# EAGLE design Synth_pcb_v1 (EAGLE 9.5.1)
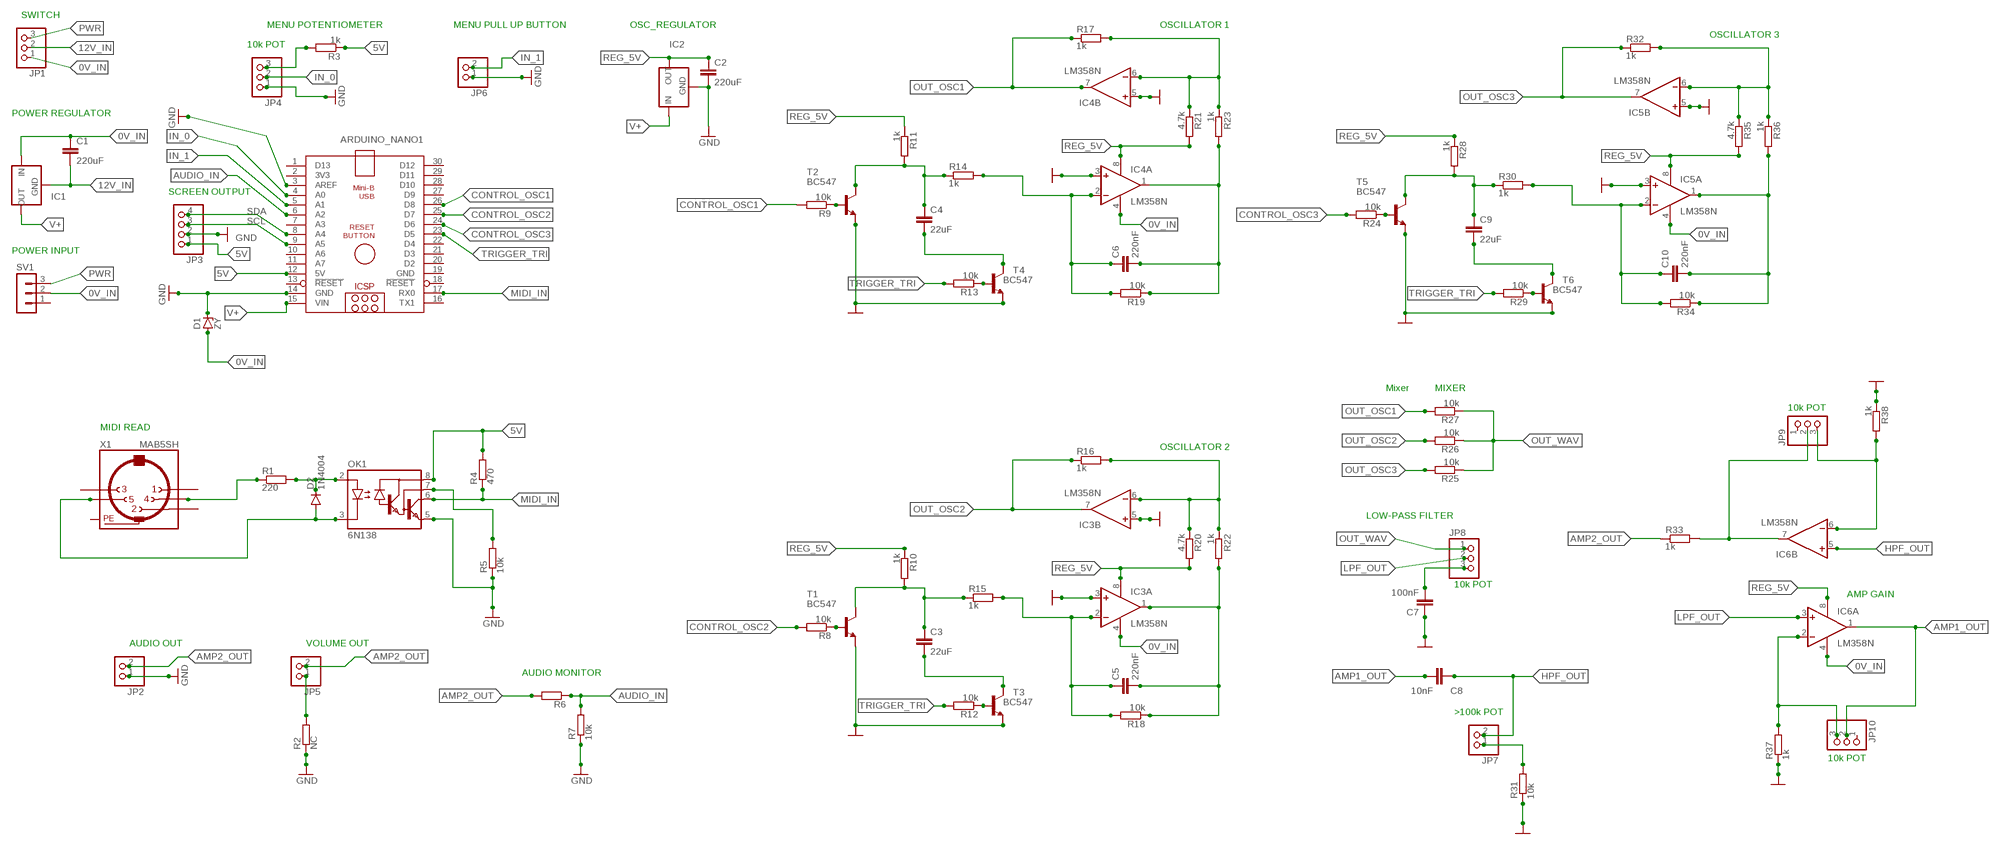
[diagram p0: schematic, sheet 1]

## Parts
ARDUINO_NANO1  ARDUINO_NANO  [ARDUINO_NANO]
C1  220uF  C2,5-3  [C2.5-3]
C2  220uF  C2,5-3  [C2.5-3]
C3  22uF  C2,5-3  [C2.5-3]
C4  22uF  C2,5-3  [C2.5-3]
C5  220nF  C2,5-3  [C2.5-3]
C6  220nF  C2,5-3  [C2.5-3]
C7  100nF  C2,5-3  [C2.5-3]
C8  10nF  C2,5-3  [C2.5-3]
C9  22uF  C2,5-3  [C2.5-3]
C10  220nF  C2,5-3  [C2.5-3]
D1  ZY  [P1Z12]
D2  1N4004  [DO41-10]
IC1  79XXS  [79XXS]
IC2  78XXS  [78XXS]
IC3  LM358N  [DIL08]
IC4  LM358N  [DIL08]
IC5  LM358N  [DIL08]
IC6  LM358N  [DIL08]
JP1  PINHD-1X3  [1X03]
JP2  PINHD-1X2  [1X02]
JP3  PINHD-1X4  [1X04]
JP4  PINHD-1X3  [1X03]
JP5  PINHD-1X2  [1X02]
JP6  PINHD-1X2  [1X02]
JP7  PINHD-1X2  [1X02]
JP8  PINHD-1X3  [1X03]
JP9  PINHD-1X3  [1X03]
JP10  PINHD-1X3  [1X03]
OK1  6N138  [DIL08]
R1  220  R-EU_0204/7  [0204/7]
R2  NC  R-EU_0204/7  [0204/7]
R3  1k  R-EU_0204/7  [0204/7]
R4  470  R-EU_0204/7  [0204/7]
R5  10k  R-EU_0204/7  [0204/7]
R6  1k  R-EU_0204/7  [0204/7]
R7  10k  R-EU_0204/7  [0204/7]
R8  10k  R-EU_0204/7  [0204/7]
R9  10k  R-EU_0204/7  [0204/7]
R10  1k  R-EU_0204/7  [0204/7]
R11  1k  R-EU_0204/7  [0204/7]
R12  10k  R-EU_0204/7  [0204/7]
R13  10k  R-EU_0204/7  [0204/7]
R14  1k  R-EU_0204/7  [0204/7]
R15  1k  R-EU_0204/7  [0204/7]
R16  1k  R-EU_0204/7  [0204/7]
R17  1k  R-EU_0204/7  [0204/7]
R18  10k  R-EU_0204/7  [0204/7]
R19  10k  R-EU_0204/7  [0204/7]
R20  4.7k  R-EU_0204/7  [0204/7]
R21  4.7k  R-EU_0204/7  [0204/7]
R22  1k  R-EU_0204/7  [0204/7]
R23  1k  R-EU_0204/7  [0204/7]
R24  10k  R-EU_0204/7  [0204/7]
R25  10k  R-EU_0204/7  [0204/7]
R26  10k  R-EU_0204/7  [0204/7]
R27  10k  R-EU_0204/7  [0204/7]
R28  1k  R-EU_0204/7  [0204/7]
R29  10k  R-EU_0204/7  [0204/7]
R30  1k  R-EU_0204/7  [0204/7]
R31  10k  R-EU_0204/7  [0204/7]
R32  1k  R-EU_0204/7  [0204/7]
R33  1k  R-EU_0204/7  [0204/7]
R34  10k  R-EU_0204/7  [0204/7]
R35  4.7k  R-EU_0204/7  [0204/7]
R36  1k  R-EU_0204/7  [0204/7]
R37  1k  R-EU_0204/7  [0204/7]
R38  1k  R-EU_0204/7  [0204/7]
SV1  MA03-1  [MA03-1]
T1  BC547  [TO92]
T2  BC547  [TO92]
T3  BC547  [TO92]
T4  BC547  [TO92]
T5  BC547  [TO92]
T6  BC547  [TO92]
X1  MAB5SH  [MAB5SH]

## Nets
0V_IN: C1.1 D1.A IC1.IN IC3.4(P:V-) IC4.4(P:V-) IC5.4(P:V-) IC6.4(P:V-) JP1.1 SV1.2
5V: ARDUINO_NANO1.12(5V) JP3.1 OK1.8(VCC) R3.1 R4.2
12V_IN: C1.2 IC1.GND JP1.2
AMP1_OUT: C8.2 IC6.1(A:OUT) JP10.2
AMP2_OUT: JP2.2 JP5.2 R6.2 R33.1
AUDIO_IN: ARDUINO_NANO1.6(A2) R6.1 R7.2
CONTROL_OSC1: ARDUINO_NANO1.26(D8) R9.2
CONTROL_OSC2: ARDUINO_NANO1.25(D7) R8.2
CONTROL_OSC3: ARDUINO_NANO1.24(D6) R24.2
GND: ARDUINO_NANO1.3(AREF) ARDUINO_NANO1.14(GND) C2.2 C7.1 D1.C IC2.GND IC3.3(A:+IN) IC3.5(B:+IN) IC4.3(A:+IN) IC4.5(B:+IN) IC5.3(A:+IN) IC5.5(B:+IN) JP2.1 JP3.2 JP4.1 JP6.1 OK1.5(GND) R2.1 R5.1 R7.1 R31.1 R37.1 R38.1 T1.1(E) T2.1(E) T3.1(E) T4.1(E) T5.1(E) T6.1(E)
GND2: JP7.1 R31.2
HPF_OUT: C8.1 IC6.5(B:+IN) JP7.2
IN_0: ARDUINO_NANO1.4(A0) JP4.2
IN_1: ARDUINO_NANO1.5(A1) JP6.2
LPF_OUT: IC6.3(A:+IN) JP8.2
MIDI_IN: ARDUINO_NANO1.17(RX0) OK1.6(VO) R4.1
N$1: D2.A OK1.3(C) X1.5
N$2: IC6.7(B:OUT) JP9.2 R33.2
N$5: D2.C OK1.2(A) R1.2
N$6: R1.1 X1.4
N$7: OK1.7(VB) R5.2
N$11: C4.2 T4.3(C)
N$13: JP4.3 R3.2
N$16: C6.1 IC4.2(A:-IN) R14.2 R19.2
N$21: R9.1 T2.2(B)
N$22: R13.1 T4.2(B)
N$24: C4.1 R11.2 R14.1 T2.3(C)
N$25: C6.2 IC4.1(A:OUT) R19.1 R23.2
N$26: IC4.6(B:-IN) R17.2 R21.1 R23.1
N$29: C3.1 R10.2 R15.1 T1.3(C)
N$30: C3.2 T3.3(C)
N$33: C5.1 IC3.2(A:-IN) R15.2 R18.2
N$34: C5.2 IC3.1(A:OUT) R18.1 R22.2
N$35: IC3.6(B:-IN) R16.2 R20.1 R22.1
N$36: R8.1 T1.2(B)
N$37: R12.1 T3.2(B)
N$40: C9.1 R28.2 R30.1 T5.3(C)
N$41: C9.2 T6.3(C)
N$44: C10.1 IC5.2(A:-IN) R30.2 R34.2
N$45: C10.2 IC5.1(A:OUT) R34.1 R36.2
N$46: IC5.6(B:-IN) R32.2 R35.1 R36.1
N$47: R24.1 T5.2(B)
N$48: R29.1 T6.2(B)
N$57: IC6.6(B:-IN) JP9.3 R38.2
N$58: IC6.2(A:-IN) JP10.3 R37.2
N$59: C7.2 JP8.3
N$63: JP5.1 R2.2
OUT_OSC1: IC4.7(B:OUT) R17.1 R27.2
OUT_OSC2: IC3.7(B:OUT) R16.1 R26.2
OUT_OSC3: IC5.7(B:OUT) R25.2 R32.1
OUT_WAV: JP8.1 R25.1 R26.1 R27.1
PWR: JP1.3 SV1.3
REG_5V: C2.1 IC2.OUT IC3.8(P:V+) IC4.8(P:V+) IC5.8(P:V+) IC6.8(P:V+) R10.1 R11.1 R20.2 R21.2 R28.1 R35.2
SCL: ARDUINO_NANO1.9(A5) JP3.3
SDA: ARDUINO_NANO1.8(A4) JP3.4
TRIGGER_TRI: ARDUINO_NANO1.23(D5) R12.2 R13.2 R29.2
V+: ARDUINO_NANO1.15(VIN) IC1.OUT IC2.IN
Unconnected: ARDUINO_NANO1.1(D13) ARDUINO_NANO1.2(3V3) ARDUINO_NANO1.7(A3) ARDUINO_NANO1.10(A6) ARDUINO_NANO1.11(A7) ARDUINO_NANO1.13(!RESET) ARDUINO_NANO1.16(TX1) ARDUINO_NANO1.18(!RESET) ARDUINO_NANO1.20(D2) ARDUINO_NANO1.21(D3) ARDUINO_NANO1.22(D4) ARDUINO_NANO1.27(D9) ARDUINO_NANO1.28(D10) ARDUINO_NANO1.29(D11) ARDUINO_NANO1.30(D12) JP9.1 JP10.1 SV1.1 X1.1 X1.2 X1.3

## Notes on the sheet
- SWITCH
- MENU POTENTIOMETER | MENU PULL UP BUTTON | OSC_REGULATOR | OSCILLATOR 1
- OSCILLATOR 3
- 10k POT
- POWER REGULATOR
- SCREEN OUTPUT
- POWER INPUT
- Mixer | MIXER
- 10k POT
- MIDI READ
- OSCILLATOR 2
- LOW-PASS FILTER
- 10k POT
- AMP GAIN
- AUDIO OUT | VOLUME OUT
- AUDIO MONITOR
- >100k POT
- 10k POT

## Power pins joined to a net without a drawn wire
GND: ARDUINO_NANO1.19(GND)
PE: X1.PE X1.PE@(PE)

## Library data of the parts
ARDUINO_NANO1 = ArduinoNanoV30:ARDUINO_NANO: Arduino Nano V3.0 Overview: The Arduino Nano is a small, complete, and breadboard-friendly board based on the ATmega328 (Arduino Nano 3.x) or ATmega168 (Arduino Nano 2.x). It has more or less the same functionality of the Arduino Duemilanove, but in a different package. It lacks only a DC power jack, and works with a Mini-B USB cable instead of a standard one. The Nano was designed and is being produced by Gravitech. Specifications: Microcontroller Atmel ATmega168 or ATmega328 Operating Voltage (logic level) 5 V Input Voltage (recommended) 7-12 V Input Voltage (limits) 6-20 V Digital I/O Pins 14 (of which 6 provide PWM output) Analog Input Pins 8 DC Current per I/O Pin 40 mA Flash Memory 16 KB (ATmega168) or 32 KB (ATmega328) of which 2 KB used by bootloader SRAM 1 KB (ATmega168) or 2 KB (ATmega328) EEPROM 512 bytes (ATmega168) or 1 KB (ATmega328) Clock Speed 16 MHz Dimensions 0.73" x 1.70" Length 45 mm Width 18 mm Weigth 5 g Power: The Arduino Nano can be powered via the Mini-B USB connection, 6-20V unregulated external power supply (pin 30), or 5V regulated external power supply (pin 27). The power source is automatically selected to the highest voltage source. Memory: The ATmega168 has 16 KB of flash memory for storing code (of which 2 KB is used for the bootloader); the ATmega328 has 32 KB, (also with 2 KB used for the bootloader). The ATmega168 has 1 KB of SRAM and 512 bytes of EEPROM (which can be read and written with the EEPROM library); the ATmega328 has 2 KB of SRAM and 1 KB of EEPROM. Input and Output: Each of the 14 digital pins on the Nano can be used as an input or output, using pinMode(), digitalWrite(), and digitalRead() functions. They operate at 5 volts. Each pin can provide or receive a maximum of 40 mA and has an internal pull-up resistor (disconnected by default) of 20-50 kOhms. In addition, some pins have specialized functions. Visit Arduino - ArduinoBoardNano <https://www.arduino.cc/en/Main/ArduinoBoardNano>
C1-C10 = capacitor-wima:C: CAPACITOR naming: grid - package width
D1 = diode:ZY: Z DIODE
D2 = diode:1N4004: DIODE general purpose rectifier, 1 A
IC1 = v-reg:79XXS: VOLTAGE REGULATOR
IC2 = v-reg:78XXS: VOLTAGE REGULATOR
IC3-IC6 = linear:LM358: OP AMP also LM158; LM258; LM2904 Source: http://cache.national.com/ds/LM/LM158.pdf
JP1 JP4 JP8-JP10 = pinhead:PINHD-1X3: PIN HEADER
JP2 JP5-JP7 = pinhead:PINHD-1X2: PIN HEADER
JP3 = pinhead:PINHD-1X4: PIN HEADER
OK1 = optocoupler:6N138: MOTOROLA OPTO COUPLER; MF: VISHAY/TELEFUNKEN; MPN: 6N138; OC_FARNELL: 9860150; OC_NEWARK: 35K5294
R1-R38 = rcl:R-EU_: RESISTOR, European symbol; SPICEPREFIX: R
SV1 = con-lstb:MA03-1: PIN HEADER; OC_FARNELL: unknown; OC_NEWARK: unknown
T1-T6 = transistor:BC547: NPN TRANSISTOR
X1 = con-hirschmann:MAB5SH: Female CONNECTOR 5 pins 90 deg. with shield, horizontal (DIN 41524); OC_FARNELL: 809883; OC_NEWARK: unknown

## Board
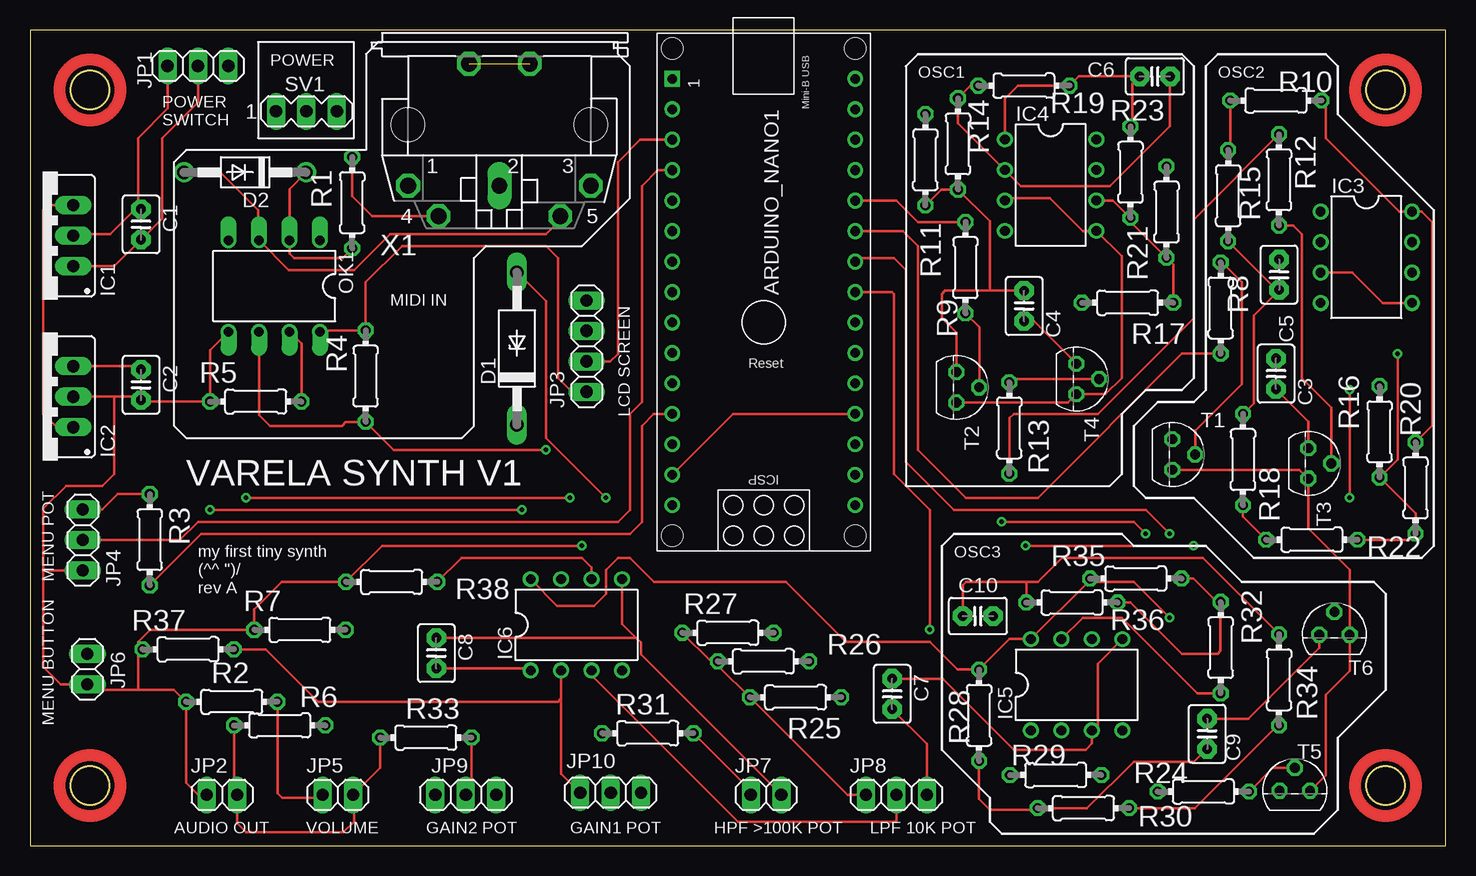
[diagram p1: board, top side]
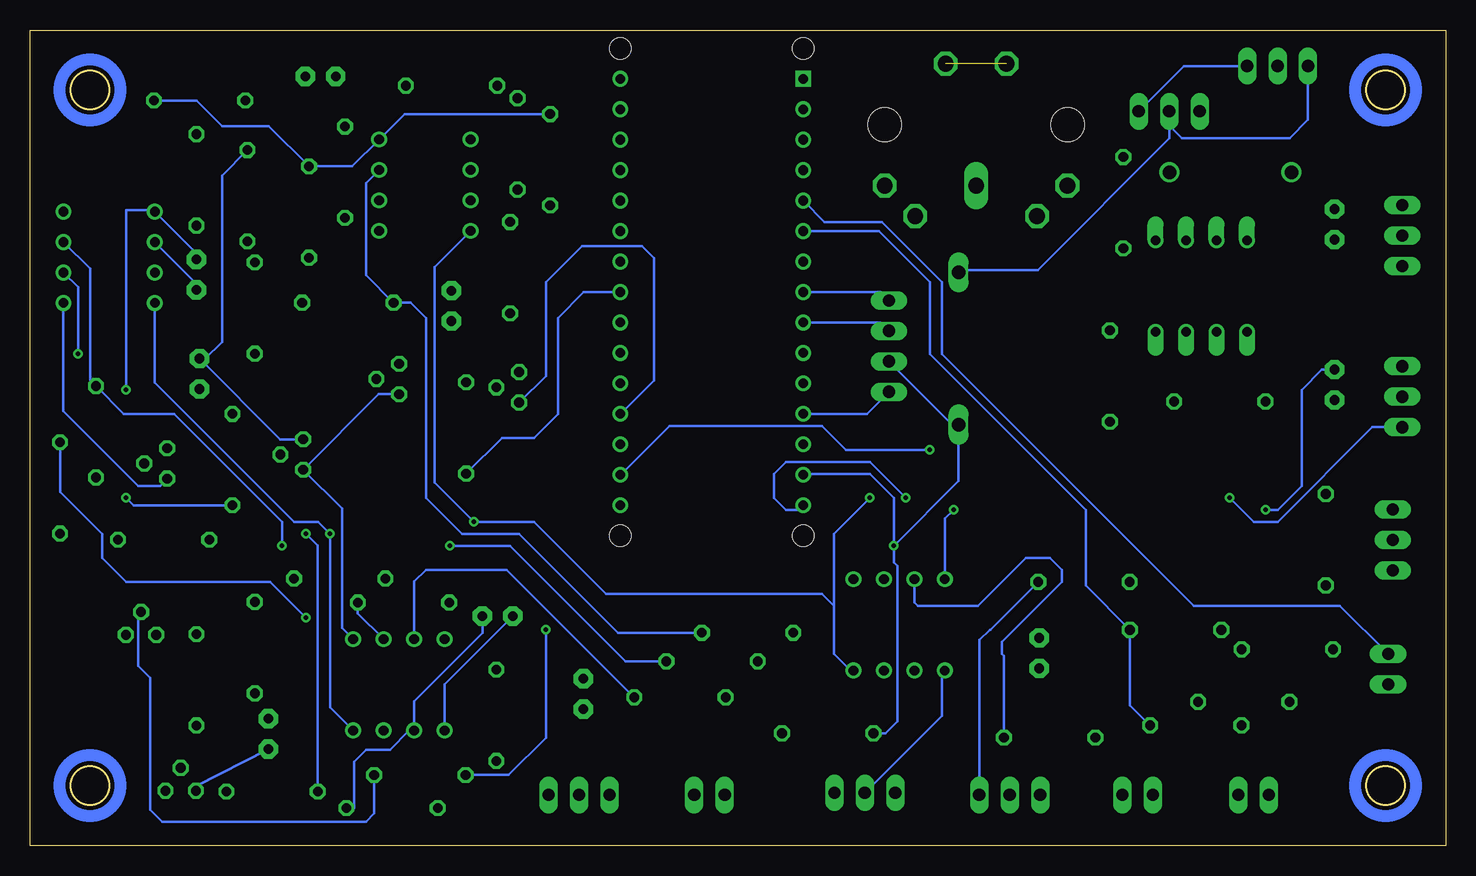
[diagram p2: board, bottom side, seen from below]

Size 118 x 68 mm. Coordinates in mm from the lower left corner, seen from the top.
Outline: 0,0 118,0 118,68 0,68 0,0
Outline: circle at 5,63 radius 1.6
Outline: circle at 113,63 radius 1.6
Outline: circle at 113,5 radius 1.6
Outline: circle at 5,5 radius 1.6
Copper layers (1*16): Top 0.035mm / dielectric 1.5mm / Bottom 0.035mm
Design rules "default": minimum track width 6mil, minimum drill 0.35mm, track to track 6mil, track to pad 6mil, pad to pad 6mil, via to via 6mil, smd to smd 6mil, copper to edge 40mil, drill to drill 6mil, minimum pad ring 10mil, minimum via ring 8mil, stop-mask expansion 4mil, vias tented up to drill 0mil, thermal gap 10mil

### Footprints (pad centres in the part's own frame; a part is rotated, then mirrored left to right if it is on the bottom)
ARDUINO_NANO = drill 0.8 square: 1 -20.32,-7.62 | drill 0.8: 2 -17.78,-7.62; 3 -15.24,-7.62; 4 -12.7,-7.62; 5 -10.16,-7.62; 6 -7.62,-7.62; 7 -5.08,-7.62; 8 -2.54,-7.62; 9 0,-7.62; 10 2.54,-7.62; 11 5.08,-7.62; 12 7.62,-7.62; 13 10.16,-7.62; 14 12.7,-7.62; 15 15.24,-7.62; 16 15.24,7.62; 17 12.7,7.62; 18 10.16,7.62; 19 7.62,7.62; 20 5.08,7.62; 21 2.54,7.62; 22 0,7.62; 23 -2.54,7.62; 24 -5.08,7.62; 25 -7.62,7.62; 26 -10.16,7.62; 27 -12.7,7.62; 28 -15.24,7.62; 29 -17.78,7.62; 30 -20.32,7.62 | hole 1.778: -22.86,-7.62; -22.86,7.62; 17.78,7.62; 17.78,-7.62
C2.5-3 = drill 0.813 pad 1.6 octagon: 1 -1.27,0; 2 1.27,0
P1Z12 = drill 1.118 long: A 6.35,0; C -6.35,0
DO41-10 = drill 1.118: A 5.08,0; C -5.08,0
79XXS = drill 1.016 long: GND -2.54,-2.54; IN 0,-2.54; OUT 2.54,-2.54
78XXS = drill 1.016 long: GND 0,-2.54; IN -2.54,-2.54; OUT 2.54,-2.54
DIL08 = drill 0.813 pad 1.27: 1 -3.81,-3.81; 2 -1.27,-3.81; 3 1.27,-3.81; 4 3.81,-3.81; 5 3.81,3.81; 6 1.27,3.81; 7 -1.27,3.81; 8 -3.81,3.81
1X03 = drill 1.016 long: 1 -2.54,0; 2 0,0; 3 2.54,0
1X02 = drill 1.016 long: 1 -1.27,0; 2 1.27,0
1X04 = drill 1.016 long: 1 -3.81,0; 2 -1.27,0; 3 1.27,0; 4 3.81,0
DIL08' = drill 0.813 offset: 1 -3.81,-3.81; 2 -1.27,-3.81; 3 1.27,-3.81; 4 3.81,-3.81; 5 3.81,3.81; 6 1.27,3.81; 7 -1.27,3.81; 8 -3.81,3.81
0204/7 = drill 0.813 octagon: 1 -3.81,0; 2 3.81,0
MA03-1 = drill 1.016 long: 1 -2.54,0; 2 0,0; 3 2.54,0
TO92 = drill 0.813 octagon: 1 1.27,0; 2 0,1.905; 3 -1.27,0
MAB5SH = drill 1.321 octagon: 1 7.62,5.08; 3 -7.62,5.08; 4 5.08,7.62; 5 -5.08,7.62; PE -2.54,-5.08; PE@ 2.54,-5.08 | drill 1.321 long: 2 0,5.08 | hole 2.794: 7.62,0; -7.62,0

### Placement (x,y rotation side)
ARDUINO_NANO1  61.16,43.61 270 top
C1  9.25,51.79 270 top
C2  9.25,38.41 270 top
C3  103.87,39.34 270 top
C4  82.87,44.99 270 top
C5  104.13,47.6 90 top
C6  93.78,64.13 180 top
C7  71.87,12.64 270 top
C8  33.87,16.04 270 top
C9  98.13,9.31 90 top
C10  79.02,19.13 180 top
D1  40.6,41.45 90 top
D2  17.93,56.13 180 top
IC1  1.06,50.85 90 top
IC2  1.06,37.42 90 top
IC3  111.4,49.05 270 top
IC4  85.08,55.06 270 top
IC5  87.25,13.4 0 top
IC6  45.55,18.4 0 top
JP1  14,65 0 top
JP2  16.01,4.22 0 top
JP3  46.4,41.64 90 top
JP4  4.4,25.48 90 top
JP5  25.66,4.22 0 top
JP6  4.78,14.71 90 top
JP7  61.36,4.22 0 top
JP8  72.22,4.22 0 top
JP9  36.33,4.22 0 top
JP10  48.41,4.4 180 top
OK1  6N138  [DIL08']  20.36,46.65 180 top
R1  26.86,53.6 270 top
R2  16.82,11.98 0 top
R3  9.98,25.5 90 top
R4  27.98,39.14 90 top
R5  18.82,37.02 0 top
R6  20.82,10.02 180 top
R7  22.5,17.98 0 top
R8  99.26,44.82 270 top
R9  77.98,48.18 90 top
R10  103.86,62.12 180 top
R11  74.64,57.18 270 top
R12  104.12,55.5 90 top
R13  81.64,34.82 270 top
R14  77.36,58.5 90 top
R15  99.88,54.18 270 top
R16  112.5,34.5 270 top
R17  91.5,45.26 0 top
R18  101.12,32.18 90 top
R19  82.86,63.36 180 top
R20  115.5,29.82 90 top
R21  94.74,52.82 90 top
R22  106.86,25.5 180 top
R23  91.74,56.14 90 top
R24  97.82,4.5 180 top
R25  63.82,12.36 0 top
R26  61.14,15.36 0 top
R27  58.18,17.74 0 top
R28  79.12,10.86 270 top
R29  85.5,5.88 180 top
R30  87.82,3.12 0 top
R31  51.5,9.36 0 top
R32  99.26,16.5 90 top
R33  33,9 0 top
R34  104.12,13.82 270 top
R35  92.18,22.26 180 top
R36  86.86,20.26 180 top
R37  13.18,16.36 0 top
R38  30.14,21.98 0 top
SV1  23.04,61.22 0 top
T1  95.22,32.6 270 top
T2  77.22,38.2 270 top
T3  106.57,31.86 270 top
T4  87.22,38.9 270 top
T5  105.44,4.57 0 top
T6  108.74,17.57 0 top
X1  39.13,60.11 180 top

### Tracks (layer width: path | path; a pad name or v marks a point on that pad's centre or on a via)
0V_IN  (via drill 0.35)
  Top 0.2: JP1.1 11.46,61.46 9,59 9,53.31 | 9,53.31 C1.1 | IC1.IN 3.75,51 6.69,51 9,53.31 | D1.A 43,45.4 43,34 v48,29 | v81,27 92,27 v93,26
  Bottom 0.2: JP1.1 11.46,60.54 13,59 22,59 23.04,60.04 SV1.2 23.04,58.96 34,48 40.4,48 D1.A | v48,29 51,26 51,20 | 51,20 51,16 49.59,14.59 IC6.4 | 51,20 52,21 70,21 76,27 v81,27 84.27,30.27 84.27,48.25 IC4.4 | IC3.4 107.59,38.59 96,27 94,27 v93,26 93,11.53 IC5.4
5V
  Top 0.2: R3.1 14.29,26 50,26 51,27 51,35 51.99,35.99 ARDUINO_NANO1.12 | OK1.8 24.28,42.95 R4.2 27.98,46.98 31,50 43,50 44,49 44,39 45.17,37.83 JP3.1
  Bottom 0.2: ARDUINO_NANO1.12 48.24,35.99 JP3.1
12V_IN
  Top 0.2: JP1.2 14,62 11,59 11,52.27 C1.2 7.04,48.31 IC1.GND
AMP1_OUT
  Top 0.2: C8.2 41.56,14.77 IC6.1
  Bottom 0.2: JP10.2 42,10.81 42,14.33 IC6.1
AMP2_OUT
  Top 0.2: R6.2 17.01,4.49 JP2.2 17.28,1.84 18,1.12 26.12,1.12 27,2 27,4.15 JP5.2 29.19,6.48 R33.1
AUDIO_IN
  Bottom 0.2: R6.1 26.31,11.7 R7.2 30,21.67 30,28 43,41 43,47 47.23,51.23 ARDUINO_NANO1.6
CONTROL_OSC1
  Top 0.2: ARDUINO_NANO1.26 72.23,53.77 74.01,51.99 R9.2
CONTROL_OSC2
  Top 0.2: ARDUINO_NANO1.25 72.77,51.23 74,50 74,33 78,29 84,29 96.01,41.01 R8.2
CONTROL_OSC3  (via drill 0.35)
  Top 0.2: ARDUINO_NANO1.24 69.09,49 72,49 73,48 73,32 77,28 93,28 v95,26
  Bottom 0.2: v95,26 94.01,25.01 R24.2
GND  (via drill 0.35)
  Top 0.2: IC2.GND 7,37.42 | 7,37.42 8.97,37.42 C2.2 9.37,37.02 R5.1 15.01,41.3 OK1.5 | 7,37.42 7,31 6,30 3,30 1.12,28.12 1.12,23 | 1.12,23 1.18,22.94 JP4.1 | 1.12,23 1.12,14.88 2.56,13.44 JP6.1 5.22,13 9,13 | JP2.1 14,4.22 13.01,5.21 R2.1 11.99,13 9,13 | R37.1 9,15.99 | 9,15.99 9,13 | 9,15.99 9,17 10,18 10.02,17.98 R7.1 18.69,19.69 20.98,21.98 R38.1 29.35,25 v46,25 | ARDUINO_NANO1.3 50.85,58.85 49,57 49,41 48.37,40.37 JP3.2 | ARDUINO_NANO1.14 58.62,35.99 ARDUINO_NANO1.19 | IC4.3 81.48,54 85,54 87.75,51.25 IC4.5 91,49.14 91,39 89.63,37.63 T4.1 86.52,36.93 T2.1 | IC3.5 112.76,45.24 110.22,47.78 IC3.3 | T1.1 105.83,31.33 T3.1 106.57,26.43 110,23 T6.1 110.01,14.57 108,12.56 108,5.86 T5.1 | C7.1 76.09,13.91 82,8 88,8 88.52,8.52 IC5.3 89,10.07 89,15.15 IC5.5
  Bottom 0.2: R31.1 46.69,9.36 45.69,10.36 45.69,23.31 46,23.62 v46,25 | v46,25 40.6,30.4 40.6,35 | 40.6,35 D1.C | JP3.2 41.03,35 40.6,35 | v46,25 46,29 48,31 53.45,31 ARDUINO_NANO1.14 | T2.1 75,39.15 75,47 72,50 67,50 66,49 66,38.77 ARDUINO_NANO1.19 | IC3.5 115.21,36.21 109,30 107.16,30 T3.1 | T4.1 88.92,37.63 T1.1 92,28.11 92,18.15 IC5.5
GND2
  Top 0.2: R31.2 60.09,4.58 JP7.1
HPF_OUT
  Top 0.2: C8.1 50.54,17.31 | JP7.2 50.92,15.93 50.92,16.93 50.54,17.31 | 50.54,17.31 49.36,18.49 IC6.5
IN_0
  Top 0.2: JP4.2 12.48,25.48 14,27 49,27 50,28 50,36 51,37 51,55 52.31,56.31 ARDUINO_NANO1.4
IN_1
  Bottom 0.2: ARDUINO_NANO1.5 51.77,52 47,52 42,47 42,41 21,20 8.8,20 JP6.2
LPF_OUT
  Top 0.2: JP8.2 72.22,2 59,2 46.82,14.18 IC6.3
MIDI_IN  (via drill 0.35)
  Top 0.2: OK1.6 19.09,35.91 20,35 26,35 26.33,35.33 R4.1 30.31,33 v43,33
  Bottom 0.2: v43,33 50,33 52,35 64.69,35 ARDUINO_NANO1.17
N$1
  Top 0.2: D2.A 15.87,56.13 19,53 19,50.55 OK1.3 21.55,48 27,48 30,51 43,51 44.21,52.21 X1.5
N$2
  Top 0.2: R33.2 36.81,4.7 JP9.2
  Bottom 0.2: R33.2 36.81,15.81 37,16 37,17 32,22 32,23 33,24 35,24 39,20 44,20 44.28,20.28 IC6.7
N$5
  Top 0.2: D2.C 21.63,54.75 OK1.2 21.63,49.37 22,49 26.07,49 R1.2
N$6
  Top 0.2: R1.1 26.86,54.14 28.51,52.49 X1.4
N$7
  Top 0.2: R5.2 22.63,41.84 OK1.7
N$11
  Top 0.2: T4.3 83.67,43.72 C4.2
N$13
  Top 0.2: JP4.3 6.02,28.02 7.31,29.31 R3.2
N$16
  Top 0.2: R19.2 78.41,63.36 R14.2 77.36,60.24 IC4.2 82.6,55 90,55 95,60 95,64.08 C6.1
N$21
  Top 0.2: R9.1 79.12,43.23 T2.2
N$22
  Top 0.2: T4.2 81.91,38.9 R13.1
N$24
  Top 0.2: R11.2 75.96,54.69 R14.1 80,52.05 80,46.26 | T2.3 77.22,42.78 76,44 76,46 76.26,46.26 80,46.26 | 80,46.26 C4.1
N$25
  Top 0.2: IC4.1 81.27,62.27 82.36,63.36 R19.1 87.44,64.13 C6.2 91.89,63.52 91.89,60.1 R23.2
N$26
  Top 0.2: IC4.6 90.28,53.79 R23.1 91.74,52.01 R21.1 95.31,48.44 R17.2
N$29
  Top 0.2: R10.2 100.05,58.16 R15.1
  Bottom 0.2: R15.1 102,55.87 102,42 103.39,40.61 C3.1 97.13,33.87 T1.3
N$30
  Top 0.2: C3.2 106.57,35.37 T3.3
N$33
  Top 0.2: R15.2 103.92,46.33 C5.1 102,44.2 102,36.87 R18.2
  Bottom 0.2: IC3.2 104.13,46.86 C5.1
N$34  (via drill 0.35)
  Top 0.2: R18.1 101.12,27.43 R22.2 | v110,29 v110,38
  Bottom 0.2: C5.2 104.13,49.4 IC3.1 107.73,53 110,53 v110,38 | R18.1 109.37,28.37 v110,29
N$35  (via drill 0.35)
  Top 0.2: R22.1 114.99,25.5 R20.1 115.5,27.69 R16.2 114,32.19 v114,41
  Bottom 0.2: IC3.6 114,46.57 v114,41
N$36
  Top 0.2: T1.2 97.12,34.6 101,38.48 101,47 99.37,48.63 R8.1
N$37
  Top 0.2: T3.2 108.47,36.52 106,39 106,51 105.31,51.69 R12.1
N$40
  Top 0.2: R28.2 79.12,3.88 80,3 83.89,3 R30.1 88.12,3.12 92,7 97,7 98.12,8.12 C9.1
  Bottom 0.2: C9.1 104.17,4.92 T5.3
N$41
  Top 0.2: T6.3 107.47,16.47 101.58,10.58 C9.2
N$44
  Top 0.2: R30.2 97.12,3.12 104.01,10.01 R34.2
  Bottom 0.2: R30.2 91,3.12 91,7 90,8 88,8 86.41,9.59 IC5.2 85.98,12.02 80.29,17.71 C10.1
N$45
  Top 0.2: R34.1 97.75,24 86,24 84,22 83,22 | C10.2 77.75,21.75 78,22 83,22 | 83,22 83.05,21.95 R36.2
  Bottom 0.2: C10.2 83.44,13.44 IC5.1
N$46
  Top 0.2: R35.1 96.99,22.26 98.94,20.31 R32.2 99.21,20.26 99.21,16.21 99,16 96,16 91.74,20.26 R36.1
  Bottom 0.2: IC5.6 90.67,19.36 R36.1
N$47
  Top 0.2: R24.1 103.61,6.47 T5.2
N$48
  Bottom 0.2: R29.1 89.31,2.69 90,2 107,2 108,3 108,14 109,15 109,19.21 T6.2
N$57
  Top 0.2: IC6.6 46.82,23.18 46,24 35.97,24 R38.2
  Bottom 0.2: R38.2 37.93,18 38,18 38.87,17.13 JP9.3
N$58
  Top 0.2: R37.2 19.64,16.36 24,12 44,12 44.28,12.28 IC6.2 44.28,5.99 JP10.3
N$59
  Top 0.2: C7.2 74.76,8.48 JP8.3
N$63
  Top 0.2: R2.2 20.63,4.37 21,4 24.17,4 JP5.1
OUT_OSC1
  Bottom 0.2: IC4.7 90,55.22 90,47.57 87.72,45.28 | 87.72,45.28 R17.1 | R27.2 68.99,17.74 77.25,26 82,26 85,29 85,44 86.28,45.28 87.72,45.28
OUT_OSC2  (via drill 0.35)
  Top 0.2: v83,25 v97,25
  Bottom 0.2: IC3.7 113,48.11 113,38.81 R16.1 110.19,36 106,36 97,27 v97,25 | R26.2 68.36,15.36 78,25 v83,25
OUT_OSC3
  Top 0.2: IC5.7 87.77,19 91,19 97.31,12.69 R32.1
  Bottom 0.2: R25.2 78.27,23 85,23 85.98,22.02 IC5.7
OUT_WAV
  Top 0.152: R27.1 56.75,15.36 R26.1 57.33,15.04 60.19,12.19
  Top 0.2: R25.1 60.19,12.19 68.15,4.22 JP8.1
PE  (1 unrouted)
PWR
  Bottom 0.2: SV1.3 21.8,65 JP1.3
REG_5V  (via drill 0.35)
  Top 0.2: IC2.OUT 8.97,39.96 C2.1 | v41,28 v15,28 | IC6.8 43.95,20 47,20 48,21 48,23 49,24 50,24 52,22 63,22 68,17 75,17 77.33,14.67 R28.1 81.66,17.21 IC5.8 88.23,22 | R10.1 108,61.79 108,59 114.14,52.86 IC3.8 116.02,52.86 116.88,52 116.88,35.01 R20.2 | 88.23,22 88.37,22.14 R35.2 | v95,19 92,22 88.23,22
  Bottom 0.2: C2.1 10.32,39.68 12,38 12,30 14,28 v15,28 | v41,28 41.74,27.26 IC6.8 | R11.1 86.77,60.99 IC4.8 91.13,56.63 R21.2 98.11,60 102,60 104.12,62.12 R10.1 | R20.2 115.5,29.5 112,26 112,24 110,22 98,22 v95,19
SCL
  Bottom 0.2: JP3.3 47.1,43.61 ARDUINO_NANO1.9
SDA
  Bottom 0.2: JP3.4 47.1,46.15 ARDUINO_NANO1.8
TRIGGER_TRI  (via drill 0.35)
  Top 0.2: R12.2 97,52.19 97,44 89,36 82,36 81.64,35.64 R13.2 | v75,18 75,28 72,31 72,46 71.85,46.15 ARDUINO_NANO1.23
  Bottom 0.2: R13.2 78.65,34 76,34 74,36 74,44 71.85,46.15 ARDUINO_NANO1.23 | R29.2 78.12,5.88 75,9 v75,18
V+  (via drill 0.35)
  Top 0.2: IC1.OUT 1.51,53.39 1.12,53 1.12,36 2.24,34.88 IC2.IN | v18,29 v45,29
  Bottom 0.2: IC2.IN 6.12,34.88 14,27 16,27 v18,29 | v45,29 48,32 55,32 56,31 56,29 55,28 53.91,28 ARDUINO_NANO1.15
(copper drawn outside any net)
  shapes: Bottom circle x4, Top circle x4

### Text on the board
tNames: POWER | OSC1 | OSC2 | POWER / SWITCH | MIDI IN | LCD SCREEN | VARELA SYNTH V1 | OSC3 | MENU POT | my first tiny synth / (^^ ")/ / rev A | MENU BUTTON | AUDIO OUT | VOLUME | GAIN2 POT | GAIN1 POT | HPF >100K POT | LPF 10K POT